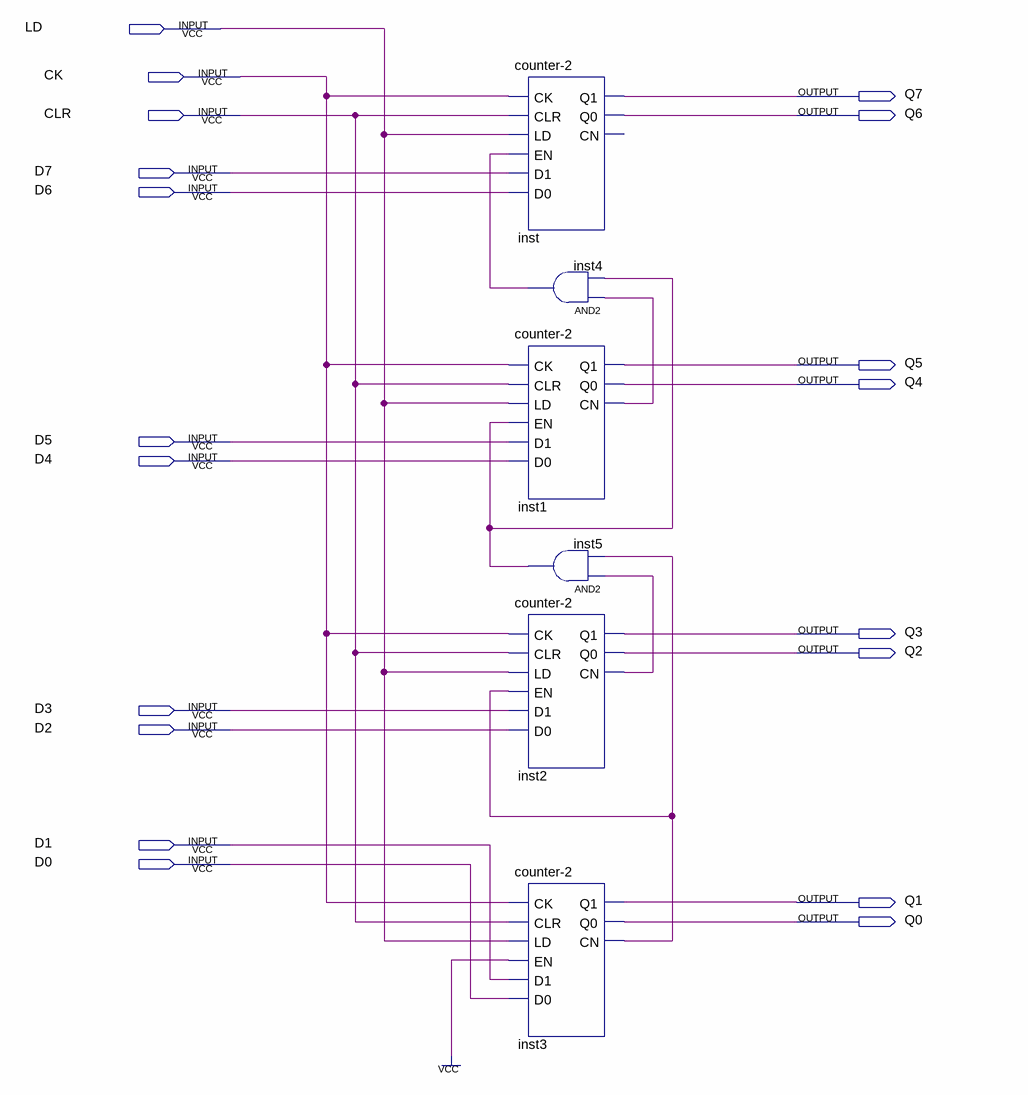
[diagram p0: schematic sheet]
// Quartus schematic counter-8.bdf as structural Verilog: 6 symbols, 19 pins
module \counter-8  (
  input  LD,
  input  CK,
  input  CLR,
  input  D7,
  input  D6,
  input  D5,
  input  D4,
  input  D3,
  input  D2,
  input  D1,
  input  D0,
  output Q7,
  output Q6,
  output Q5,
  output Q4,
  output Q3,
  output Q2,
  output Q1,
  output Q0
);

  wire inst1_cn, inst2_cn, inst3_cn, inst4_out, inst5_out;

  \counter-2  inst (.CK(CK), .CLR(CLR), .LD(LD), .EN(inst4_out), .D1(D7), .D0(D6), .Q1(Q7), .Q0(Q6));  // open: CN
  and inst4 (inst4_out, inst1_cn, inst5_out);
  \counter-2  inst1 (.CK(CK), .CLR(CLR), .LD(LD), .EN(inst5_out), .D1(D5), .D0(D4), .Q1(Q5), .Q0(Q4), .CN(inst1_cn));
  and inst5 (inst5_out, inst2_cn, inst3_cn);
  \counter-2  inst2 (.CK(CK), .CLR(CLR), .LD(LD), .EN(inst3_cn), .D1(D3), .D0(D2), .Q1(Q3), .Q0(Q2), .CN(inst2_cn));
  \counter-2  inst3 (.CK(CK), .CLR(CLR), .LD(LD), .EN(1'b1), .D1(D1), .D0(D0), .Q1(Q1), .Q0(Q0), .CN(inst3_cn));
endmodule
